# Altium schematic sheet Sheet1.SchDoc
size A4; SheetNumber: 1; SheetTotal: 4
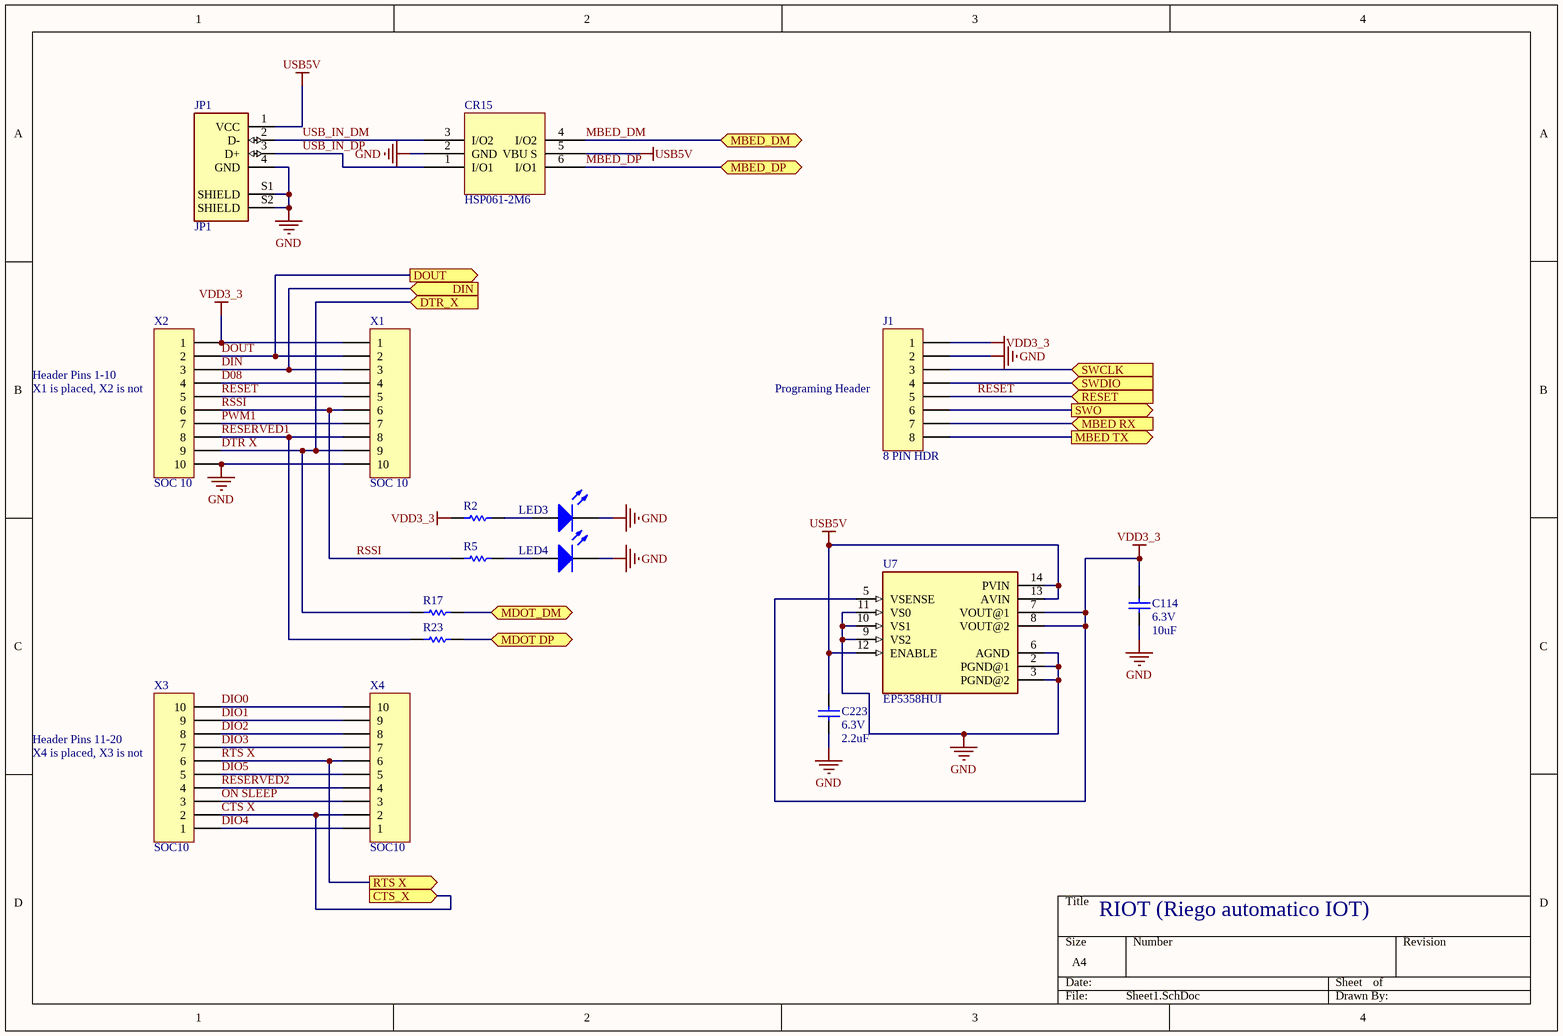
[diagram p0: Sheet1.SchDoc]

## Parts
C114  6.3V  value 10uF  [CAPC1005X35N]
C223  6.3V  value 2.2uF  [CAPC1005X35N]
CR15  HSP061-2M6  [PSON40P120X130X55-6N]
J1  8 PIN HDR  [HDR1X8]
JP1  JP1  [GCT_USB1130-15-A_REVA]
LED3  LED0  [FP-SML-P11MTT86-MFG]  (value not drawn)
LED4  LED0  [FP-SML-P11MTT86-MFG]  (value not drawn)
R2  Res1  [RESC1005X35N]  (value not drawn)
R5  Res1  [RESC1005X35N]  (value not drawn)
R17  Res1  [RESC1005X35N]  (value not drawn)
R23  Res1  [RESC1005X35N]  (value not drawn)
U7  EP5358HUI  [QFN40P225X250X110-16N]
X1  SOC 10  [HDR1X10]
X2  SOC 10  [HDR1X10]
X3  SOC10  [HDR1X10]
X4  SOC10  [HDR1X10]

## Ports
CTS_X (in), DIN (in), DOUT (out), DTR_X (in), MBED RX (in), MBED TX (out), MBED_DM (bidir), MBED_DP (bidir), MDOT DP (bidir), MDOT_DM (bidir), RESET (in), RTS X (out), SWCLK (in), SWDIO (in), SWO (out)

## Nets
GND: C114.1 C223.1 CR15.2(GND) J1.2 JP1.4(GND) JP1.S1(SHIELD) JP1.S2(SHIELD) LED3.2(K) LED4.2(K) U7.2(PGND@1) U7.3(PGND@2) U7.6(AGND) U7.9(VS2) U7.10(VS1) U7.11(VS0) X1.10 X2.10
USB5V: C223.2 CR15.5(VBU_S) JP1.1(VCC) U7.12(ENABLE) U7.13(AVIN) U7.14(PVIN)
VDD3_3: C114.2 J1.1 R2.1 U7.5(VSENSE) U7.7(VOUT@1) U7.8(VOUT@2) X1.1 X2.1
CTS X: X3.2 X4.2 ; port CTS_X
D08: X1.4 X2.4
DIN: X1.3 X2.3 ; port DIN
DIO0: X3.10 X4.10
DIO1: X3.9 X4.9
DIO2: X3.8 X4.8
DIO3: X3.7 X4.7
DIO4: X3.1 X4.1
DIO5: X3.5 X4.5
DOUT: X1.2 X2.2 ; port DOUT
DTR X: R17.1 X1.9 X2.9 ; port DTR_X
MBED RX: J1.7 ; port MBED RX
MBED TX: J1.8 ; port MBED TX
MBED_DM: CR15.4(I/O2) ; port MBED_DM
MBED_DP: CR15.6(I/O1) ; port MBED_DP
MDOT DP: R23.2 ; port MDOT DP
MDOT_DM: R17.2 ; port MDOT_DM
ON SLEEP: X3.3 X4.3
PWM1: X1.7 X2.7
RESERVED1: R23.1 X1.8 X2.8
RESERVED2: X3.4 X4.4
RESET: J1.5 X1.5 X2.5 ; port RESET
RSSI: R5.1 X1.6 X2.6
RTS X: X3.6 X4.6 ; port RTS X
SWCLK: J1.3 ; port SWCLK
SWDIO: J1.4 ; port SWDIO
SWO: J1.6 ; port SWO
USB_IN_DM: CR15.3(I/O2) JP1.2(D-)
USB_IN_DP: CR15.1(I/O1) JP1.3(D+)
NetLED3_1: LED3.1(A) R2.2
NetLED4_1: LED4.1(A) R5.2

## Notes on the sheet
- Header Pins 1-10
- (near X2) X1 is placed, X2 is not
- (near J1) Programing Header
- (near X3) X4 is placed, X3 is not
- Header Pins 11-20
- RIOT (Riego automatico IOT)

## Library data of the parts
C114 C223 = Cap: Capacitor; Published: 8-Jun-2000; LatestRevisionDate: 17-Jul-2002; LatestRevisionNote: Re-released for DXP Platform.; PackageReference: RAD-0.3; Publisher: Altium Limited; PackageDescription: Radial Cap, Thru-Hole; 2 Leads; 0.3 in Pin Spacing
J1 = Header 8: Header, 8-Pin; LatestRevisionDate: 17-Jul-2002; LatestRevisionNote: Re-released for DXP Platform.; Publisher: Altium Limited
JP1 = USB1130-15-A_REVA: MF: Global Connector Technology; SnapEDA_Link: https://www.snapeda.com/parts/USB1130-15-A/Global%20Connector%20Technology/view-part/5160678/?ref=snap; Package: None; Check_prices: https://www.snapeda.com/parts/USB1130-15-A/Global%20Connector%20Technology/view-part/5160678/?ref=eda; MP: USB1130-15-A; Value: *; Availability: Unavailable; Price: None
LED3 LED4 = LED0: Typical INFRARED GaAs LED; Published: 8-Jun-2000; LatestRevisionDate: 08-Jul-2005; LatestRevisionNote: Mech Layer 1 removed.; PackageReference: LED-0; Publisher: Altium Limited; PackageDescription: LED; 2 Leads
R2 R5 = Res1: Resistor; Value: 110; Published: 8-Jun-2000; LatestRevisionDate: 17-Jul-2002; LatestRevisionNote: Re-released for DXP Platform.; PackageReference: AXIAL-0.3; Publisher: Altium Limited; PackageDescription: Axial Device, Thru-Hole; 2 Leads; 0.3 in Pin Spacing
R17 R23 = Res1: Resistor; Value: 0; Published: 8-Jun-2000; LatestRevisionDate: 17-Jul-2002; LatestRevisionNote: Re-released for DXP Platform.; PackageReference: AXIAL-0.3; Publisher: Altium Limited; PackageDescription: Axial Device, Thru-Hole; 2 Leads; 0.3 in Pin Spacing
U7 = EP5358HUI: Non-Isolated PoL Module DC DC Converter 1 Output 1.8 ~ 3.3V 600mA 2.4V - 5.5V Input; MF: Intel; Purchase-URL: https://pricing.snapeda.com/search/part/EP5358HUI/?ref=eda; Package: PowerTFQFN-16 Altera; MP: EP5358HUI; Value: *; Digi-Key_Part_Number: 544-2870-1-ND; Check_prices: https://www.snapeda.com/parts/EP5358HUI/Intel/view-part/324506/?ref=eda; SnapEDA_Link: https://www.snapeda.com/parts/EP5358HUI/Intel/view-part/324506/?ref=snap
X1-X4 = Header 10: Header, 10-Pin; LatestRevisionDate: 17-Jul-2002; LatestRevisionNote: Re-released for DXP Platform.; Publisher: Altium Limited